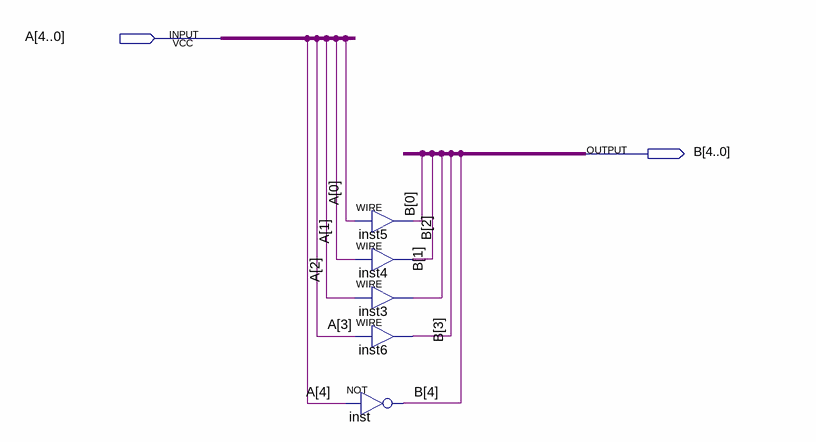
[diagram p0: schematic sheet]
// Quartus schematic NPBIT.bdf as structural Verilog: 5 symbols, 2 pins
module NPBIT (
  input  [4:0] A,
  output [4:0] B
);

  assign B[0] = A[0];  // WIRE inst5
  assign B[1] = A[1];  // WIRE inst4
  assign B[2] = A[2];  // WIRE inst3
  assign B[3] = A[3];  // WIRE inst6
  not inst (B[4], A[4]);
endmodule
